# Altium schematic sheet LEDs.SchDoc
size A
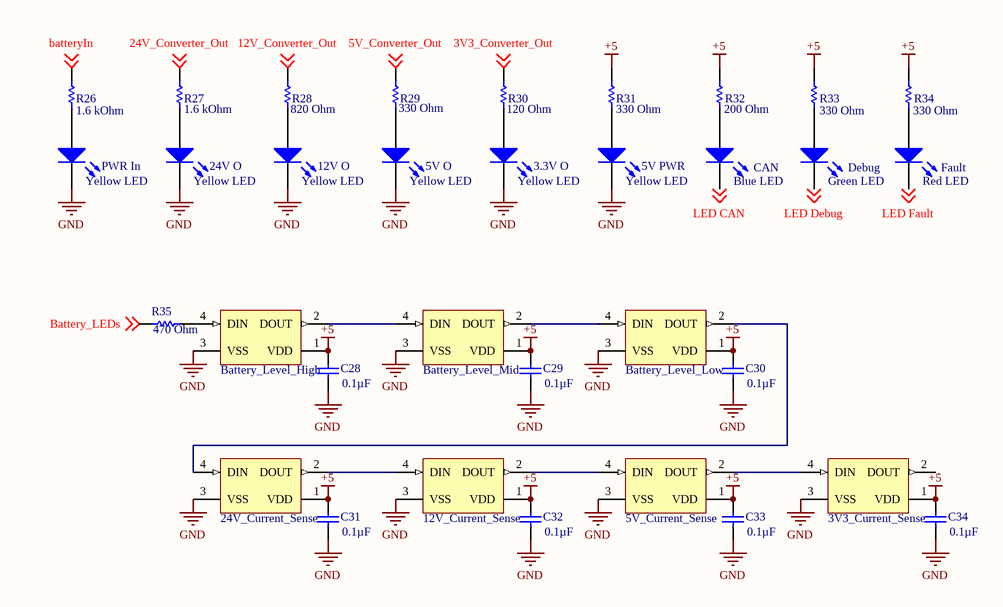
[diagram p0: LEDs.SchDoc]

## Parts
3.3V_O  Yellow LED  [0805_A]
3V3_Current_Sense  RBG_LED  [RGB_LED_1]  (value not drawn)
5V_Current_Sense  RBG_LED  [RGB_LED_1]  (value not drawn)
5V_O  Yellow LED  [0805_A]
5V_PWR  Yellow LED  [0805_A]
12V_Current_Sense  RBG_LED  [RGB_LED_1]  (value not drawn)
12V_O  Yellow LED  [0805_A]
24V_Current_Sense  RBG_LED  [RGB_LED_1]  (value not drawn)
24V_O  Yellow LED  [0805_A]
Battery_Level_High  RBG_LED  [RGB_LED_1]  (value not drawn)
Battery_Level_Low  RBG_LED  [RGB_LED_1]  (value not drawn)
Battery_Level_Mid  RBG_LED  [RGB_LED_1]  (value not drawn)
C28  value 0.1µF  [Cap 0805]  (hidden comment: 0805 Capacitor)
C29  value 0.1µF  [Cap 0805]  (hidden comment: 0805 Capacitor)
C30  value 0.1µF  [Cap 0805]  (hidden comment: 0805 Capacitor)
C31  value 0.1µF  [Cap 0805]  (hidden comment: 0805 Capacitor)
C32  value 0.1µF  [Cap 0805]  (hidden comment: 0805 Capacitor)
C33  value 0.1µF  [Cap 0805]  (hidden comment: 0805 Capacitor)
C34  value 0.1µF  [Cap 0805]  (hidden comment: 0805 Capacitor)
CAN  Blue LED  [0805_A]
Debug  Green LED  [0805_A]
Fault  Red LED  [0805_A]
PWR_In  Yellow LED  [0805_A]
R26  value 1.6 kOhm  [RESC0805(2012)_N]  (hidden comment: Resistor 0805)
R27  value 1.6 kOhm  [RESC0805(2012)_N]  (hidden comment: Resistor 0805)
R28  value 820 Ohm  [RESC0805(2012)_N]  (hidden comment: Resistor 0805)
R29  value 330 Ohm  [RESC0805(2012)_N]  (hidden comment: Resistor 0805)
R30  value 120 Ohm  [RESC0805(2012)_N]  (hidden comment: Resistor 0805)
R31  value 330 Ohm  [RESC0805(2012)_N]  (hidden comment: Resistor 0805)
R32  value 200 Ohm  [RESC0805(2012)_N]  (hidden comment: Resistor 0805)
R33  value 330 Ohm  [RESC0805(2012)_N]  (hidden comment: Resistor 0805)
R34  value 330 Ohm  [RESC0805(2012)_N]  (hidden comment: Resistor 0805)
R35  value 470 Ohm  [RESC0805(2012)_N]  (hidden comment: Resistor 0805)

## Nets
+5: 3V3_Current_Sense.1(VDD) 5V_Current_Sense.1(VDD) 12V_Current_Sense.1(VDD) 24V_Current_Sense.1(VDD) Battery_Level_High.1(VDD) Battery_Level_Low.1(VDD) Battery_Level_Mid.1(VDD) C28.1 C29.1 C30.1 C31.1 C32.1 C33.1 C34.1 R31.1 R32.2 R33.2 R34.2
GND: 3.3V_O.1(K) 3V3_Current_Sense.3(VSS) 5V_Current_Sense.3(VSS) 5V_O.1(K) 5V_PWR.1(K) 12V_Current_Sense.3(VSS) 12V_O.1(K) 24V_Current_Sense.3(VSS) 24V_O.1(K) Battery_Level_High.3(VSS) Battery_Level_Low.3(VSS) Battery_Level_Mid.3(VSS) C28.2 C29.2 C30.2 C31.2 C32.2 C33.2 C34.2 PWR_In.1(K)
3V3_Converter_Out: R30.1 ; off-sheet 3V3_Converter_Out
5V_Converter_Out: R29.1 ; off-sheet 5V_Converter_Out
12V_Converter_Out: R28.2 ; off-sheet 12V_Converter_Out
24V_Converter_Out: R27.1 ; off-sheet 24V_Converter_Out
Battery_LEDs: R35.1 ; off-sheet Battery_LEDs
batteryIn: R26.2 ; off-sheet batteryIn
LED CAN: CAN.1(K) ; off-sheet LED CAN
LED Debug: Debug.1(K) ; off-sheet LED Debug
LED Fault: Fault.1(K) ; off-sheet LED Fault
Net3.3V_O_2: 3.3V_O.2(A) R30.2
Net3V3_Current_Sense_4: 3V3_Current_Sense.4(DIN) 5V_Current_Sense.2(DOUT)
Net5V_Current_Sense_4: 5V_Current_Sense.4(DIN) 12V_Current_Sense.2(DOUT)
Net5V_O_2: 5V_O.2(A) R29.2
Net5V_PWR_2: 5V_PWR.2(A) R31.2
Net12V_Current_Sense_4: 12V_Current_Sense.4(DIN) 24V_Current_Sense.2(DOUT)
Net12V_O_2: 12V_O.2(A) R28.1
Net24V_Current_Sense_4: 24V_Current_Sense.4(DIN) Battery_Level_Low.2(DOUT)
Net24V_O_2: 24V_O.2(A) R27.2
NetBattery_Level_High_2: Battery_Level_High.2(DOUT) Battery_Level_Mid.4(DIN)
NetBattery_Level_High_4: Battery_Level_High.4(DIN) R35.2
NetBattery_Level_Low_4: Battery_Level_Low.4(DIN) Battery_Level_Mid.2(DOUT)
NetCAN_2: CAN.2(A) R32.1
NetDebug_2: Debug.2(A) R33.1
NetFault_2: Fault.2(A) R34.1
NetPWR_In_2: PWR_In.2(A) R26.1

Not connected (* = marked no-connect by the designer): 3V3_Current_Sense 2(DOUT)

## Library data of the parts
3.3V_O 5V_O 5V_PWR 12V_O 24V_O CAN Debug PWR_In = LED: Standard 0805 LED; PackageReference: 0805_A
  3.3V_O 5V_O 5V_PWR 12V_O 24V_O PWR_In: Color: Yellow
  CAN: Color: Blue
  Debug: Color: Green
3V3_Current_Sense 5V_Current_Sense 12V_Current_Sense 24V_Current_Sense Battery_Level_High Battery_Level_Low Battery_Level_Mid = CMP-003-0014-1: LED ADAI-WS2812B-4; ComponentLink1Description: Digi-Key_Purchase_URL; ComponentLink2URL: https://docs.broadcom.com/docs/AV02-4194EN; Source: LED_RGB.SchLib; ComponentLink1URL: https://www.digikey.com/en/products/detail/broadcom-limited/ASMB-MTB1-0A3A2/5695366; Component Type: Standard; Design Item ID: RBG_LED; ComponentLink2Description: Datasheet_Link; Digi-Key_Part_Number: 516-3280-1-ND; Pin Count: 4
C28-C34 = CMP-002-0000-1: Standard Capacitor; Tolerance (%): ±10%; Case Size/Dimension: 0805; Mounting Technology: SurfaceMount; ComponentLink1URL: https://www.digikey.com/product-detail/en/kemet/C0805C104Z5VACTU/399-1177-1-ND/411452; ComponentLink1Description: Digi-Key_Purchase_URL; Digi-Key_Part_Number: 399-1177-1-ND; Digikey URL: https://www.digikey.com/product-detail/en/kemet/C0805C104Z5VACTU/399-1177-1-ND/411452; Pin Count: 2; Package Description: 2-Pin Surface Mount Device, Body 2.01 x 1.25 mm; Source: Standard Cap.SchLib; Component Type: Standard; ComponentLink2URL: https://content.kemet.com/datasheets/KEM_C1005_Y5V_SMD.pdf; Package Reference: 0805; ComponentLink2Description: Datasheet Link; Design Item ID: 0805 Capacitor
Fault = LED: Standard 0805 LED; Manufacturer: Wuerth Elektronik; PartNumber: 150080SS75000; PackageReference: 0805_A; ComponentLink2URL: http://katalog.we-online.com/led/datasheet/150080SS75000.pdf; ComponentLink1URL: http://www.we-online.com; Color: Super Red; ComponentLink2Description: Datasheet; ComponentLink1Description: Manufacturer URL
R26 R27 R29 R31-R34 = Resistor 0805: Generic 0805 Resistor; Case-EIA: 0805; Technology: SMT
R28 R30 = Resistor 0805: Generic 0805 Resistor; Case-EIA: 0805; Tolerance: 5 %; Case-Metric: 2012; Power: 0.125 W; Technology: SMT
R35 = CMP-006-0001-1: Generic 0805 Resistor; Case-EIA: 0805; Design Item ID: Resistor 0805; Technology: SMT; Pin Count: 2